# Altium schematic sheet TivaC_Schemetic_Sheet2.SchDoc
size B; SheetNumber: 2; SheetTotal: 2
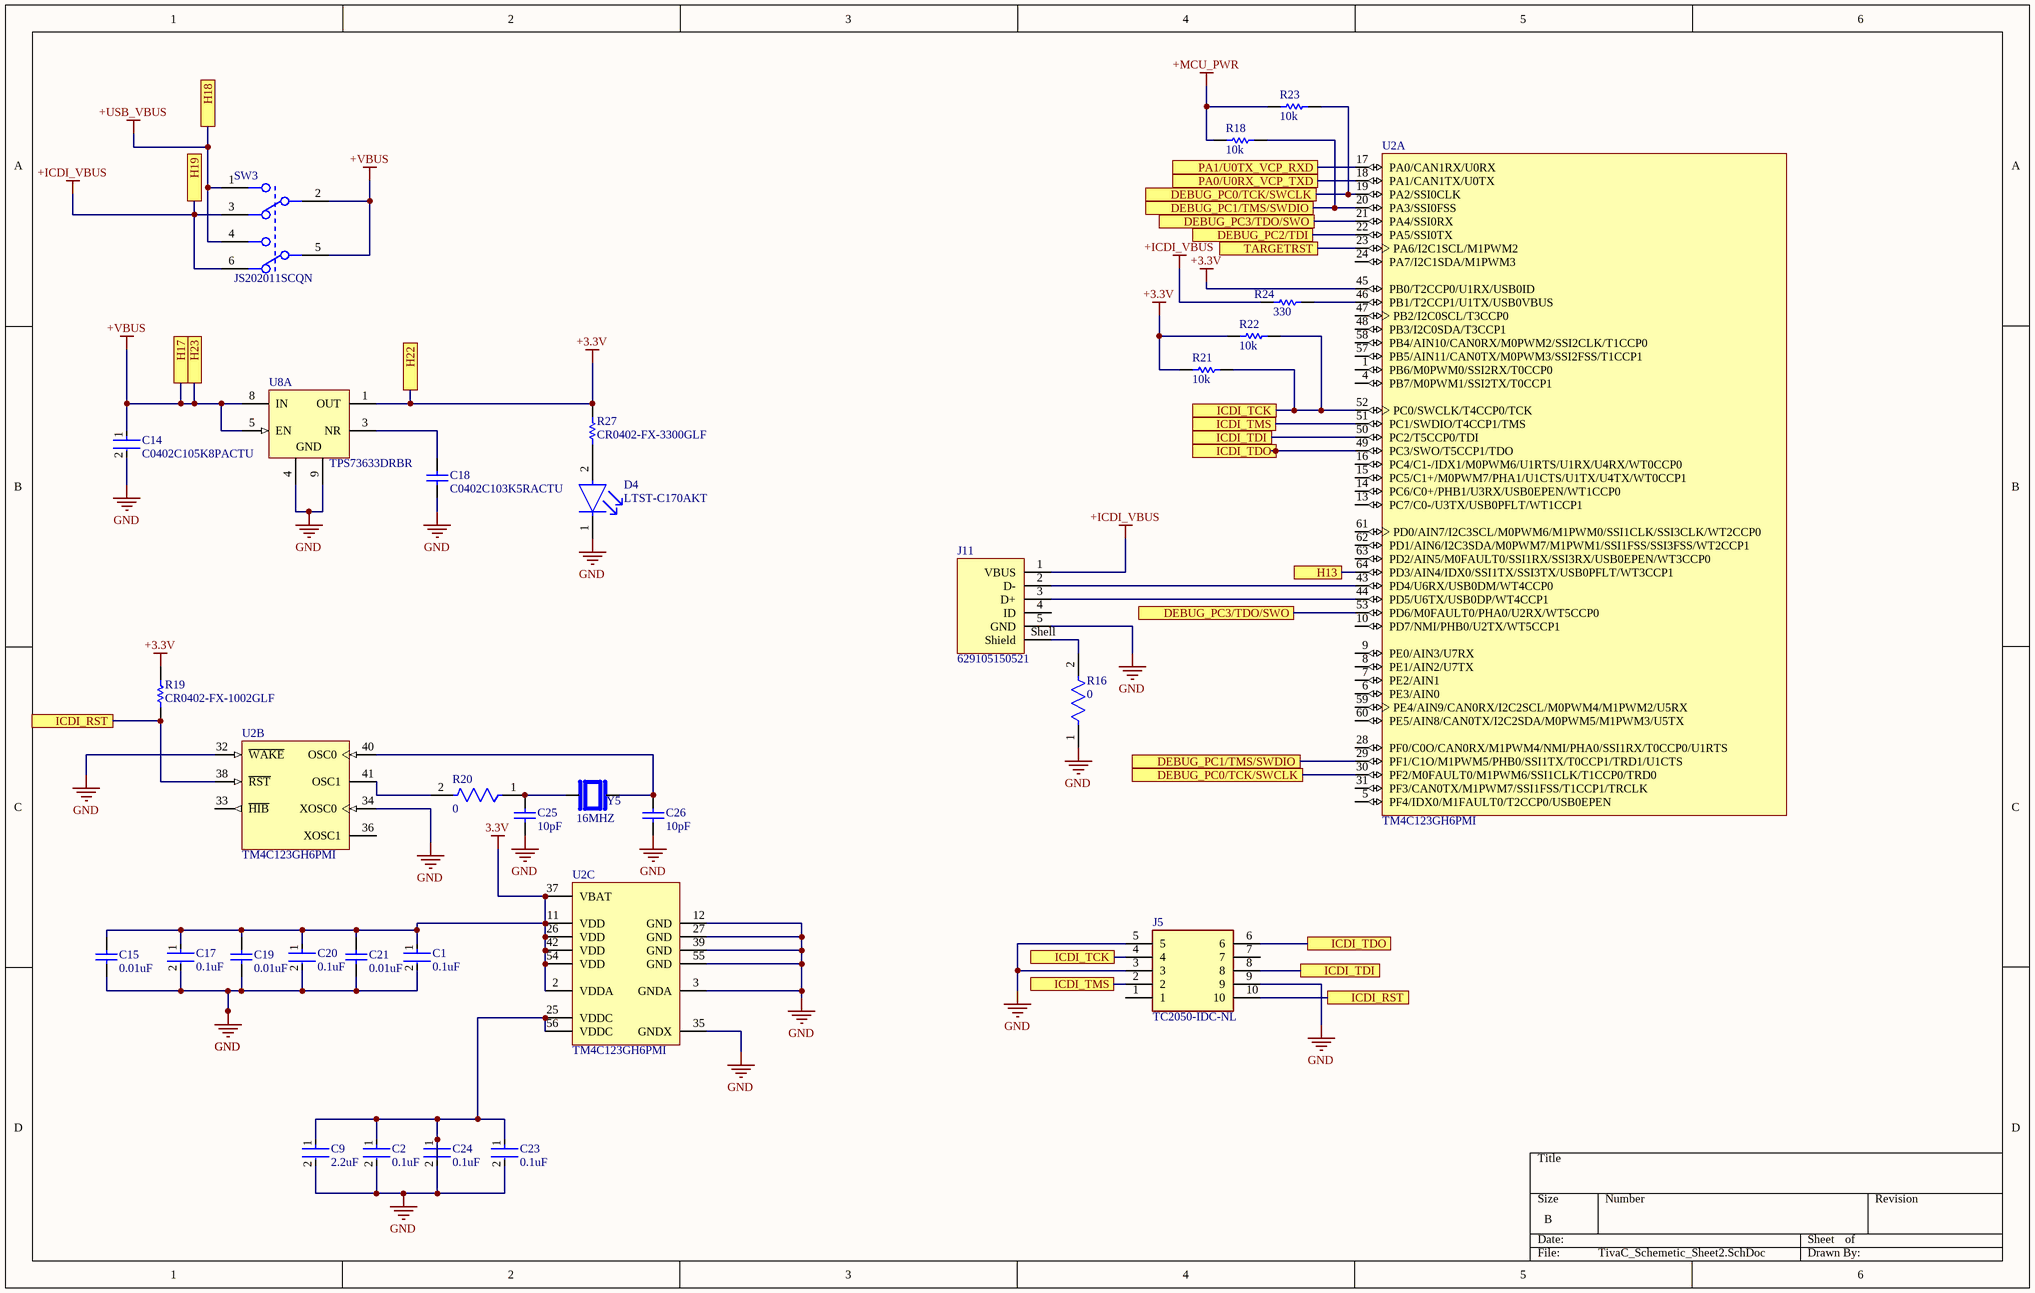
[diagram p0: TivaC_Schemetic_Sheet2.SchDoc]

## Parts
C1  0.1uF  [FP-C0402-BB-MFG]
C2  0.1uF  [FP-C0402-BB-MFG]
C9  2.2uF  [FP-C0603C225K4PACTU-MFG]
C14  C0402C105K8PACTU  [FP-C0402C105K8PACTU-MFG]
C15  0.01uF  [CAPC1005X55X30LL05T10]
C17  0.1uF  [FP-C0402-BB-MFG]
C18  C0402C103K5RACTU  [CAPC1005X55X30LL05T10]
C19  0.01uF  [CAPC1005X55X30LL05T10]
C20  0.1uF  [FP-C0402-BB-MFG]
C21  0.01uF  [CAPC1005X55X30LL05T10]
C23  0.1uF  [FP-C0402-BB-MFG]
C24  0.1uF  [FP-C0402-BB-MFG]
C25  10pF  [CAPC1005X55X25ML05T05]
C26  10pF  [CAPC1005X55X25ML05T05]
D4  LTST-C170AKT  [FP-LTST-C170AKT-MFG]
J5  TC2050-IDC-NL  [TAG-CONNECT_TC2050-IDC-NL]
J11  629105150521  [629105150521]
R16  0  [FP-CR0603-MFG]
R18  10k  [RESC1005X40X25NL10T10]
R19  CR0402-FX-1002GLF  [RESC1005X40X25NL10T10]
R20  0  [FP-CR0603-MFG]
R21  10k  [RESC1005X40X25NL10T10]
R22  10k  [RESC1005X40X25NL10T10]
R23  10k  [RESC1005X40X25NL10T10]
R24  330  [RESC1005X40X25NL10T10]
R27  CR0402-FX-3300GLF  [RESC1005X40X25NL10T10]
SW3  JS202011SCQN  [FP-JS202011SCQN-MFG]
U2  TM4C123GH6PMI  [PM0064A_L]  (parts A,B,C of 3)
U8  TPS73633DRBR  [DRB0008A_V]  (part A of 2)
Y5  16MHZ  [XTAL_NX5032GA-16.000000MHZ-LN-CD-1]

## Ports
DEBUG_PC0/TCK/SWCLK (see TivaC_Schemetic_Sheet1[2A], TivaC_Schemetic_Sheet2[4A]), DEBUG_PC0/TCK/SWCLK (see TivaC_Schemetic_Sheet1[2A], TivaC_Schemetic_Sheet2[4C]), DEBUG_PC1/TMS/SWDIO (see TivaC_Schemetic_Sheet1[2A], TivaC_Schemetic_Sheet2[4A]), DEBUG_PC1/TMS/SWDIO (see TivaC_Schemetic_Sheet1[2A], TivaC_Schemetic_Sheet2[4C]), DEBUG_PC2/TDI (see TivaC_Schemetic_Sheet1[2A]), DEBUG_PC3/TDO/SWO (see TivaC_Schemetic_Sheet1[2A], TivaC_Schemetic_Sheet2[4A]), DEBUG_PC3/TDO/SWO (see TivaC_Schemetic_Sheet1[2A], TivaC_Schemetic_Sheet2[4B]), H13 (see TivaC_Schemetic_Sheet1[4B]), H17, H18, H19, H22, H23, ICDI_RST (see TivaC_Schemetic_Sheet2[1C]), ICDI_RST (see TivaC_Schemetic_Sheet2[4D]), ICDI_TCK (see TivaC_Schemetic_Sheet2[4B]), ICDI_TCK (see TivaC_Schemetic_Sheet2[4C]), ICDI_TDI (see TivaC_Schemetic_Sheet2[4B]), ICDI_TDI (see TivaC_Schemetic_Sheet2[4D]), ICDI_TDO (see TivaC_Schemetic_Sheet2[4B]), ICDI_TDO (see TivaC_Schemetic_Sheet2[4C]), ICDI_TMS (see TivaC_Schemetic_Sheet2[4B]), ICDI_TMS (see TivaC_Schemetic_Sheet2[4D]), PA0/U0RX_VCP_TXD (see TivaC_Schemetic_Sheet1[1A]), PA1/U0TX_VCP_RXD (see TivaC_Schemetic_Sheet1[1A]), TARGETRST (see TivaC_Schemetic_Sheet1[1A], TivaC_Schemetic_Sheet1[6C])

## Nets
3.3V: C1.1 C15.2 C17.1 C19.2 C20.1 C21.2 U2.2(VDDA) U2.11(VDD) U2.26(VDD) U2.37(VBAT) U2.42(VDD) U2.54(VDD)
+3.3V: R19.2 R21.1 R22.1 R27.2 U2.45(PB0/T2CCP0/U1RX/USB0ID) U8.1(OUT) ; port H22
+ICDI_VBUS: J11.1(VBUS) R24.1 SW3.3 SW3.6 ; port H19
+MCU_PWR: R18.1 R23.1
+USB_VBUS: SW3.1 SW3.4 ; port H18
+VBUS: C14.1 SW3.2 SW3.5 U8.5(EN) U8.8(IN) ; port H23, port H17
GND: C1.2 C2.2 C9.2 C14.2 C15.1 C17.2 C18.1 C19.1 C20.2 C21.1 C23.2 C24.2 C25.1 C26.1 D4.1(C) J5.3 J5.5 J5.9 J11.5(GND) R16.1 U2.3(GNDA) U2.12(GND) U2.27(GND) U2.32(~{WAKE}) U2.34(XOSC0) U2.35(GNDX) U2.39(GND) U2.55(GND) U8.4(GND) U8.9(GND)
DEBUG_PC0/TCK/SWCLK: R23.2 U2.19(PA2/SSI0CLK) U2.30(PF2/M0FAULT0/M1PWM6/SSI1CLK/T1CCP0/TRD0) ; port DEBUG_PC0/TCK/SWCLK
DEBUG_PC1/TMS/SWDIO: R18.2 U2.20(PA3/SSI0FSS) U2.29(PF1/C1O/M1PWM5/PHB0/SSI1TX/T0CCP1/TRD1/U1CTS) ; port DEBUG_PC1/TMS/SWDIO
DEBUG_PC2/TDI: U2.22(PA5/SSI0TX) ; port DEBUG_PC2/TDI
DEBUG_PC3/TDO/SWO: U2.21(PA4/SSI0RX) U2.53(PD6/M0FAULT0/PHA0/U2RX/WT5CCP0) ; port DEBUG_PC3/TDO/SWO
H13: U2.64(PD3/AIN4/IDX0/SSI1TX/SSI3TX/USB0PFLT/WT3CCP1) ; port H13
ICDI_RST: J5.10 R19.1 U2.38(~{RST}) ; port ICDI_RST
ICDI_TCK: J5.4 R21.2 R22.2 U2.52(PC0/SWCLK/T4CCP0/TCK) ; port ICDI_TCK
ICDI_TDI: J5.8 U2.50(PC2/T5CCP0/TDI) ; port ICDI_TDI
ICDI_TDO: J5.6 U2.49(PC3/SWO/T5CCP1/TDO) ; port ICDI_TDO
ICDI_TMS: J5.2 U2.51(PC1/SWDIO/T4CCP1/TMS) ; port ICDI_TMS
PA0/U0RX_VCP_TXD: U2.18(PA1/CAN1TX/U0TX) ; port PA0/U0RX_VCP_TXD
PA1/U0TX_VCP_RXD: U2.17(PA0/CAN1RX/U0RX) ; port PA1/U0TX_VCP_RXD
TARGETRST: U2.23(PA6/I2C1SCL/M1PWM2) ; port TARGETRST
NetC2_1: C2.1 C9.1 C23.1 C24.1 U2.25(VDDC) U2.56(VDDC)
NetC18_2: C18.2 U8.3(NR)
NetC25_2: C25.2 R20.1 Y5.1
NetC26_2: C26.2 U2.40(OSC0) Y5.2
NetD4_2: D4.2(A) R27.1
NetJ11_2: J11.2(D-) U2.43(PD4/U6RX/USB0DM/WT4CCP0)
NetJ11_3: J11.3(D+) U2.44(PD5/U6TX/USB0DP/WT4CCP1)
NetJ11_Shell: J11.Shell(Shield) R16.2
NetR20_2: R20.2 U2.41(OSC1)
NetR24_2: R24.2 U2.46(PB1/T2CCP1/U1TX/USB0VBUS)

Not connected (* = marked no-connect by the designer): J5 1 7; J11 4(ID); U2 1(PB6/M0PWM0/SSI2RX/T0CCP0) 4(PB7/M0PWM1/SSI2TX/T0CCP1) 5(PF4/IDX0/M1FAULT0/T2CCP0/USB0EPEN) 6(PE3/AIN0) 7(PE2/AIN1) 8(PE1/AIN2/U7TX) 9(PE0/AIN3/U7RX) 10(PD7/NMI/PHB0/U2TX/WT5CCP1) 13(PC7/C0-/U3TX/USB0PFLT/WT1CCP1) 14(PC6/C0+/PHB1/U3RX/USB0EPEN/WT1CCP0) 15(PC5/C1+/M0PWM7/PHA1/U1CTS/U1TX/U4TX/WT0CCP1) 16(PC4/C1-/IDX1/M0PWM6/U1RTS/U1RX/U4RX/WT0CCP0) 24(PA7/I2C1SDA/M1PWM3) 28(PF0/C0O/CAN0RX/M1PWM4/NMI/PHA0/SSI1RX/T0CCP0/U1RTS) 31(PF3/CAN0TX/M1PWM7/SSI1FSS/T1CCP1/TRCLK) 33(~{HIB}) 36(XOSC1) 47(PB2/I2C0SCL/T3CCP0) 48(PB3/I2C0SDA/T3CCP1) 57(PB5/AIN11/CAN0TX/M0PWM3/SSI2FSS/T1CCP1) 58(PB4/AIN10/CAN0RX/M0PWM2/SSI2CLK/T1CCP0) 59(PE4/AIN9/CAN0RX/I2C2SCL/M0PWM4/M1PWM2/U5RX) 60(PE5/AIN8/CAN0TX/I2C2SDA/M0PWM5/M1PWM3/U5TX) 61(PD0/AIN7/I2C3SCL/M0PWM6/M1PWM0/SSI1CLK/SSI3CLK/WT2CCP0) 62(PD1/AIN6/I2C3SDA/M0PWM7/M1PWM1/SSI1FSS/SSI3FSS/WT2CCP1) 63(PD2/AIN5/M0FAULT0/SSI1RX/SSI3RX/USB0EPEN/WT3CCP0)

## Library data of the parts
C1 C2 C17 C20 C23 C24 = CMP-1034-02068-3: CAP CER 0.1UF 16V 5% X7R 0402; Manufacturer: Kemet; Manufacturer Part Number: C0402C104J4RACTU; Value: 0.10 μF; Temperature Coefficient: 15%; Tolerance: 0.05; Material: Ceramic; ComponentLink2URL: https://content.kemet.com/datasheets/KEM_C1002_X7R_SMD.pdf; Automotive: No; Device Class L2: Capacitors; Temperature: -55°C to +125°C; RoHS: TRUE; Voltage Rating: 16 V; ComponentLink2Description: Datasheet; Device Class L3: Ceramic Capacitors; Temperature Range Low: -55°C; Ipc Land Pattern Name: CAPC10050X50; Device Class L1: Passive Components; Temperature Range High: +125°C; Package: C0402-BB; Capacitance: 0.10 μF; Category: Cap; Mouser Description: CAP CER 0.1UF 16V X7R 0402; Height: 0.55mm; Digikey Description: CAP CER 0.1UF 16V 5% X7R 0402; Octopart: https://octopart.com/c0402c104j4ractu-kemet-12573893; Temperature Characteristic: X7R; Lead Free: Yes
C9 = CMP-2006-02259-2: CAP CER 2.2UF 16V X5R 0603; Dielectric Material: Ceramic; Tolerance: 10%; Dissipation Factor: 5%; Series: C; Voltage Rating (DC): 16V; REACH SVHC: No SVHC; RoHS Compliant: Yes; Number of Pins: 2; Max Operating Temperature: 85°C; Voltage Rating: 16V; Min Operating Temperature: -55°C; Termination: SMD/SMT; Dielectric: X5R; Packaging: Tape and Reel; Contact Plating: Tin; Case Code (Metric): 1608; Height: 0.8mm; Capacitance: 2.2uF; Case/Package: 0603; Width: 0.8mm; Construction: Flat; Depth: 0.8mm; Thickness: 0.034inch; Radiation Hardening: No; Length: 1.6mm; Mount: Surface Mount; Case Code (Imperial): 0603; Voltage: 16V; Package Quantity: 1; Lead Free: Lead Free
C14 = CMP-2008-02081-2: CAP CER 1UF 10V X5R 0402; Dielectric Material: Ceramic; Dissipation Factor: 5%; Tolerance: 10%; Number of Pins: 2; Contact Plating: Tin; Min Operating Temperature: -55°C; Termination: SMD/SMT; Lead Free: Lead Free; Construction: Flat; Voltage Rating (DC): 10V; Mount: Surface Mount; Series: C; Thickness: 0.022inch; Width: 0.5mm; Radiation Hardening: No; Capacitance: 1uF; Dielectric: X5R; Height: 0.5mm; Voltage: 10V; Length: 1mm; Depth: 0.5mm; Max Operating Temperature: 85°C; Package Quantity: 1; Packaging: Tape and Reel; RoHS Compliant: Yes; Case Code (Imperial): 0402; Case Code (Metric): 1005; REACH SVHC: No SVHC; Voltage Rating: 10V; Case/Package: 0402
C15 C19 C21 = CMP-1034-01886-2: Part Number: C0402C103K5RACTU; Manufacturer: Kemet
C18 = CMP-1034-01886-2: Manufacturer: Kemet; Part Number: C0402C103K5RACTU
C25 C26 = CMP-2100-03589-1: Chip Capacitor, 10 pF, +/- 5%, 50 V, -55 to 125 degC, 0402 (1005 Metric), RoHS, Tape and Reel; Manufacturer: Yageo; Insulation Resistance: 100GR; Voltage Rating (DC): 50V; Dielectric Material: Ceramic; Temperature Coefficient: 30ppm/degC; Dielectric: C0G; Termination: SMD/SMT; Package Reference: 0402; Lead Free: LeadFree; Composition: Ceramic; Tolerance: 5%; Case Code (Metric): 1005; Voltage Rating: 50V; Packaging: TapeandReel; Manufacturer URL: http://www.yageo.com/; REACH SVHC: NoSVHC; Max Operating Temperature: 125degC; Length: 1mm; Mount: SurfaceMount; Depth: 0.5mm; Min Operating Temperature: -55degC; Number of Pins: 2; Width: 0.02inch; Datasheet Version: Rev. 14, 07/2016; Package Quantity: 1; Datasheet URL: http://www.yageo.com/documents/recent/UPY-GP_NP0_16V-to-50V_14.pdf; Case Code (Imperial): 0402; RoHSCompliant: True; Radiation Hardening: No; Height: 0.5mm; Case/Package: 0402; Thickness: 0.022inch; Capacitance: 10pF; Package Description: 2-Pin Surface Mount Device, Body 1 x 0.5 mm; Voltage: 50V
D4 = CMP-22017-000022-1: LED ORANGE CLEAR SMD; Number of Elements: 1; Reverse Voltage: 5V; Forward Voltage: 2.1V; Dominant Wavelength: 602nm; Power Dissipation: 100mW; Wavelength: 610nm; Test Current: 10mA; Luminous Intensity: 2mcd; Lens Color: Colorless; Lens Style: Diffused; Forward Current: 30mA; Viewing Angle: 130°; Depth: 1.25mm; Lens Transparency: Clear; Height: 1.1mm; Illumination Color: Orange; Lead Free: Lead Free; Case Code (Imperial): 0805; Max Power Dissipation: 100mW; Color: Orange; Min Operating Temperature: -55°C; Width: 1.25mm; Package Quantity: 1; Max Operating Temperature: 85°C; Case/Package: 0805; Number of LEDs: 1; Number of Pins: 2; Packaging: Tape and Reel; Length: 2mm; Radiation Hardening: No; Mount: Surface Mount; Case Code (Metric): 2012
J5 = TC2050-IDC-NL: MSP-FET430 Flash Emulation Tool Plug-Of-Nailsâ„¢ Adapter Cable; MF: Tag-Connect LLC; Price: None; Availability: In Stock; MP: TC2050-IDC-NL; Package: None; SnapEDA_Link: https://www.snapeda.com/parts/TC2050-IDC-NL/Tag-Connect+LLC/view-part/?ref=snap; Check_prices: https://www.snapeda.com/parts/TC2050-IDC-NL/Tag-Connect+LLC/view-part/?ref=eda; Value: *; Purchase-URL: https://pricing.snapeda.com/search/part/TC2050-IDC-NL/?ref=eda
J11 = CMP-1502-03252-3: NexarPartId: 52645113; Number of Contacts: 5; Contact Resistance: 30mΩ; Connector Type: USB; Voltage Rating: 30V; Current Rating: 3A; USB Standard: USB 2.0; Gender: Receptacle; Insulation Resistance: 1GΩ; Height: 2.86mm; REACH SVHC: Unknown; RoHS: Compliant; Features: Shielded; Termination: SMD/SMT; Number of Pins: 5; Contact Plating: Gold; Packaging: Tape and Reel; Contact Material: Gold; Mount: Horizontal, Surface Mount; Max Operating Temperature: 85°C; Lead Free: Lead Free; Min Operating Temperature: -40°C; Orientation: Horizontal; Operating Supply Voltage: 30V
R16 R20 = CMP-07231-000023-1: Thick Film Chip Resistors 0603 0Ω 0.1W 5%; Power Rating: 100mW; Resistance: 0mR; Voltage Rating (DC): 50V; Tolerance: 1%; Temperature Coefficient: 500ppm/°C; Depth: 0.8mm; Height: 0.45mm; Case Code (Metric): 1608; Number of Pins: 2; Max Operating Temperature: 155°C; Mount: Surface Mount; REACH SVHC: No SVHC; Radiation Hardening: No; Width: 0.8mm; Max Power Dissipation: 100mW; Thickness: 457um; Package Quantity: 5000; Composition: Thick Film; Case/Package: 0603; Military Standard: Not; Packaging: Tape and Reel; Voltage Rating: 50V; Case Code (Imperial): 0603; Min Operating Temperature: -55°C; Contact Plating: Tin; Length: 1.6mm; Termination: SMD/SMT
R18 R21-R23 = CMP-2002-04694-1: Manufacturer: Bourns; Part Number: CR0402-FX-1002GLF
R19 = CMP-2002-04694-1: Manufacturer: Bourns; Part Number: CR0402-FX-1002GLF
R24 = CMP-1011-00454-2: Part Number: CR0402-FX-3300GLF; Manufacturer: Bourns
R27 = CMP-1011-00454-2: 330; Manufacturer: Bourns; Part Number: CR0402-FX-3300GLF
SW3 = CMP-2000-05087-3: SWITCH SLIDE DPDT 300MA 6V; Switch Function: On-On; Actuator Type: Standard; Switch Travel: 2mm; Actuator Color: Black; Contact Resistance: 70mR; Electrical Life: 5000Cycles; Actuator Material: Nylon; REACH SVHC: No SVHC; Series: JS; Min Operating Temperature: -20°C; Depth: 7.5mm; Housing Material: Nylon; Voltage Rating (DC): 6V; Max Operating Temperature: 85°C; Contact Current Rating: 300mA; Package Quantity: 1; Contact Plating: Silver; Contact Material: Copper Alloy; Throw Configuration: DPDT; Current Rating: 300mA; Orientation: Vertical; Max Current Rating: 300mA; Max Voltage Rating (DC): 6V; Flammability Rating: UL94 V-2; Length: 9mm; Packaging: Tape and Reel; Mount: Surface Mount; Actuator Length: 2mm; Lead Free: Lead Free; Termination: Gull Wing; Radiation Hardening: No
U2 = CMP-0945-00006-2: Tiva C Series Microcontroller, 256 KB Flash, 32 KB SRAM, 12 Bit, 12 Channels, -40 to 85 degC, 64-Pin LQFP (PM), Green (RoHS & no Sb/Br); Manufacturer: Texas Instruments; Program Memory: 256 KB; UART: 4; ADC Channels: 12; Data Memory: 32 KB; Max Speed: 80 MHz; ADC Resolution: 12 Bit; GPIOs: 43; Tiva Series: Connected MCUs; Prefix: Qualified Device; I2C: 2; ComponentLink1URL: http://www.ti.com/; ComponentLink1Description: Manufacturer URL; PackageDescription: 64-Pin Plastic Quad Flatpack, Body 10 x 10 mm, Pitch 0.5 mm; Temperature Range: -40 to 85 degC; Mounting Technology: Surface Mount; ComponentLink3URL: http://www.ti.com/litv/pdf/mtqf008a; ComponentLink2Description: Datasheet; ComponentLink2URL: http://www.ti.com/lit/ds/symlink/tm4c123gh6pm.pdf; PartNumber: TM4C123GH6PMI; DatasheetVersion: Rev. 15741.2722; PackageReference: PM0064A; RoHS: TRUE; ComponentLink3Description: Package Specification; PackageVersion: 4040152/C
U8 = CMP-0395-00621-2: Single Output Low Noise LDO, 400 mA, Fixed 3.3 V Output, 1.7 to 5.5 V Input, with Reverse Current Protection, 8-pin SON (DRB), -40 to 85 degC, Green (RoHS & no Sb/Br); Manufacturer: Texas Instruments; Fixed Output Options(V): 3.3; Rating: Catalog; Accuracy(%): 1; Vdo(Typ)(mV): 75; SubFamily: Single Channel LDO; Vin(Min)(V): 1.7; Iq(Typ)(mA): 0.3; Vin(Max)(V): 5.5; Iout(Max)(A): 0.4; ComponentLink4URL: Samples URL:http://www.ti.com/product/tps73633#samples; PackageDescription: 8-Pin Plastic Small Outline, Body 3 x 3 mm, Pitch 0.65 mm; ComponentLink4Description: URL Link1; PackageReference: DRB0008A; Eco-Plan: Green (RoHS & no Sb/Br); ComponentLink1URL: http://www.ti.com/; PartNumber: TPS73633DRBR; Vout Adj(Max)(V): 3.3; ComponentLink3Description: Package Specification; ComponentLink3URL: http://www.ti.com/litv/pdf/mpds118h; PackageVersion: 4203482-2/K; ComponentLink2Description: Datasheet; DatasheetVersion: SBVS038T; Vout Adj(Min)(V): 3.3; Mounting Technology: Surface Mount; ComponentLink2URL: http://www.ti.com/general/docs/lit/getliterature.tsp?genericPartNumber=TPS73633&fileType=pdf; ComponentLink1Description: Manufacturer URL
Y5 = NX5032GA-16.000000MHZ-LN-CD-1: Package: None; Price: None; Availability: Unavailable; MP: NX5032GA-16.000000MHZ-LN-CD-1; Value: *